# Altium schematic sheet MCU.SchDoc
size A; SheetNumber: 1; SheetTotal: 5
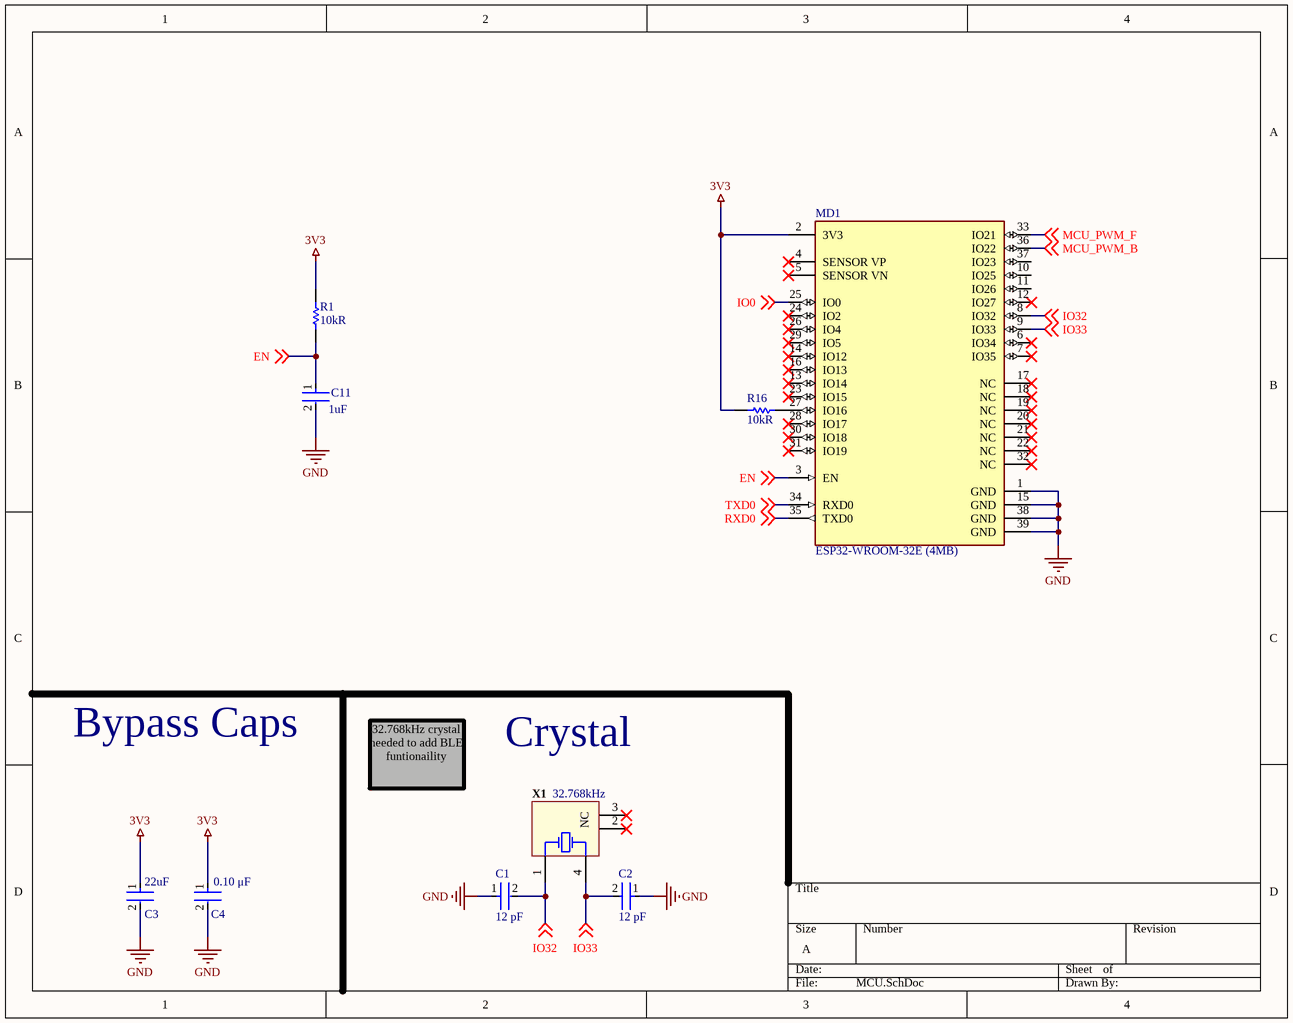
[diagram p0: MCU.SchDoc]

## Parts
C1  value 12 pF  [FP-C0805C-DN-MFG]  (hidden comment: C0805C120J5GACTU)
C2  value 12 pF  [FP-C0805C-DN-MFG]  (hidden comment: C0805C120J5GACTU)
C3  Capacitance: 22uF  [FP-GRM21B-0_15-MFG]  (hidden comment: GRM21BR60J226ME39L)
C4  value 0.10 μF  [FP-C1206C-EB-MFG]  (hidden comment: C1206C104K1RACTU)
C11  Capacitance: 1uF  [FP-CL21-IPC_A]  (hidden comment: CL21B105KOFNNNE)
MD1  ESP32-WROOM-32E (4MB)  [FP-ESP32-WROOM-32E_4MB-MFG]
R1  value 10kR  [RESC2013X60X35NL10T20]  (hidden comment: RC0805FR-0710KL)
R16  value 10kR  [RESC2013X60X35NL10T20]  (hidden comment: RC0805FR-0710KL)
X1  Frequency: 32.768kHz  [ABRA-ABS25-4_V]  (hidden comment: ABS25-32.768KHZ-6-T)

## Nets
3V3: C3.1 C4.1 MD1.2(3V3) R1.1 R16.2
GND: C1.1 C2.1 C3.2 C4.2 C11.2 MD1.1(GND) MD1.15(GND) MD1.38(GND) MD1.39(GND)
EN: C11.1 MD1.3(EN) R1.2 ; off-sheet EN
IO0: MD1.25(IO0) ; off-sheet IO0
IO32: C1.2 MD1.8(IO32) X1.1(X1) ; off-sheet IO32
IO33: C2.2 MD1.9(IO33) X1.4(X2) ; off-sheet IO33
MCU_PWM_B: MD1.36(IO22) ; off-sheet MCU_PWM_B
MCU_PWM_F: MD1.33(IO21) ; off-sheet MCU_PWM_F
RXD0: MD1.35(TXD0) ; off-sheet RXD0
TXD0: MD1.34(RXD0) ; off-sheet TXD0
NetMD1_27: MD1.27(IO16) R16.1

Not connected (* = marked no-connect by the designer): MD1 4(SENSOR_VP)* 5(SENSOR_VN)* 6(IO34)* 7(IO35)* 10(IO25) 11(IO26) 12(IO27)* 13(IO14)* 14(IO12)* 16(IO13)* 17(NC)* 18(NC)* 19(NC)* 20(NC)* 21(NC)* 22(NC)* 23(IO15)* 24(IO2)* 26(IO4)* 28(IO17)* 29(IO5)* 30(IO18)* 31(IO19)* 32(NC)* 37(IO23); X1 2(NC)* 3(NC)*

## Notes on the sheet
- Bypass Caps
- Crystal
- 32.768kHz crystal needed to add BLE funtionaility

## Library data of the parts
C1 C2 = CMP-2007-00441-2: CAP CER 12PF 50V C0G/NP0 0805; Manufacturer: KEMET; Temperature Characteristic: C0G; Temperature Coefficient: 30ppm/°C; Material: Ceramic; Tolerance: 0.05; Multilayer: Yes; Tolerance  (fill in as +-): 5%; Capacitance: 12 pF; Height: 0.88mm; ComponentLink2URL: https://content.kemet.com/datasheets/KEM_C1003_C0G_SMD.pdf; Automotive: No; Device Class L2: Capacitors; Digikey Description: CAP CER 12PF 50V C0G/NP0 0805; Device Class L3: Ceramic Capacitors; Voltage Rating: 50 V; Mouser Description: Multilayer Ceramic Capacitors MLCC - SMD/SMT 50volts 12pF C0G 5%; Device Class L1: Passive Components; ComponentLink2Description: Datasheet; RoHS: TRUE; Temperature Range High: +125°C; Lead Free: Yes; Category: Cap; Ipc Land Pattern Name: CAPC200125X78; Package: C0805C-DN; Manufacturer Part Number: C0805C120J5GACTU; Octopart: https://octopart.com/c0805c120j5gactu-kemet-126518; Temperature Range Low: -55°C; Temperature: -55°C to +125°C; Supplier: Digikey; Supplier Part Number: 399-C0805C120J5GAC7800CT-ND; Stock: 105044; Pricing: 1=0.12, 10=0.081, 50=0.0482, 100=0.038, 500=0.02804, 1000=0.02321 (USD); Mounting Technology: Surface Mount; Pins: 2; Dielectric Material: Ceramic; Case/Package: 0805; Terminal Finish: Nickel; Package Shape: Rectangular; Min Operating Temperature: -55°C; Max Operating Temperature: 125°C; JESD-609 Code: e3; Capacitor Type: Ceramic; Packaging: Tape and Reel; Tolerance (fill in as +-): 5%; Rated DC Voltage (URdc): 50V; Temperature Characteristics Code: C0G; Termination: Wraparound; Reach SVHC Compliant: Yes; RoHS Compliant: Yes; ComponentLink1URL: https://datasheet.ciiva.com:443/pdfs/VipMasterIC/IC/KEME/KEME-S-A0007600110/KEME-S-A0007597378-1.pdf?src-supplier=IHS+Markit; ComponentLink1Description: https://datasheet.ciiva.com:443/pdfs/VipMasterIC/IC/KEME/KEME-S-A0007600110/KEME-S-A0007597378-1.pdf?src-supplier=IHS+Markit
C3 = CMP-2007-03385-2: Chip Multilayer Ceramic Capacitors for General Purpose, 0805, 22uF, X5R, 15%, 20%, 6.3V; Manufacturer: Murata; Multilayer: Yes; Material: Ceramic; Max Operating Temperature: 85°C; Voltage: 6.3V; Min Operating Temperature: -55°C; Case/Package: 0805; Thickness: 0.053inch; Dielectric: X5R; Packaging: Tape and Reel; Depth: 1.25mm; Termination: SMD/SMT; Voltage Rating (DC): 6.3V; Radiation Hardening: No; Tolerance: 20%; Mount: Surface Mount; Lead Free: Lead Free; Package Quantity: 1; REACH SVHC: No SVHC; Voltage Rating: 6.3V; Length: 2mm; Case Code (Imperial): 0805; Case Code (Metric): 2012; Width: 0.049inch; Height: 1.25mm; Supplier: Digikey; Supplier Part Number: 490-1719-1-ND; Manufacturer Part Number: GRM21BR60J226ME39L; RoHS: Yes; Category: Ceramic Capacitors; Stock: 3670406; Pricing: 1=0.3, 10=0.196, 50=0.1444, 100=0.1177, 500=0.09288, 1000=0.07844 (USD); Mounting Technology: Surface Mount; Pins: 2; Dielectric Material: Ceramic; Package Shape: Rectangular; Terminal Finish: Nickel; JESD-609 Code: e3; Value: 22uF; Capacitor Type: Ceramic; Tolerance  (fill in as +-): 20%; Package Style: SMTMeter; Tolerance (fill in as +-): 20%; Rated DC Voltage (URdc): 6.3V; Temperature Characteristics Code: X5R; Reach SVHC Compliant: Yes; RoHS Compliant: Yes; ComponentLink1URL: https://psearch.en.murata.com:443/capacitor/product/GRM21BR60J226ME39%23.pdf?src-supplier=IHS+Markit; ComponentLink1Description: https://psearch.en.murata.com:443/capacitor/product/GRM21BR60J226ME39%23.pdf?src-supplier=IHS+Markit
C4 = CMP-03020-000153-1: CAP CER 0.1UF 100V X7R 1206; Manufacturer: KEMET; Tolerance: 0.1; Material: Ceramic; Temperature Coefficient: 15%; Automotive Grade: Grade 0; Multilayer: Yes; Tolerance  (fill in as +-): 10%; Voltage Rating: 100 V; Automotive: Yes; Ipc Land Pattern Name: CAPC320160X78; Device Class L1: Passive Components; ComponentLink2Description: Datasheet; Temperature Range Low: -55°C; Category: Cap; Octopart: https://octopart.com/c1206c104k1ractu-kemet-89521; Height: 0.88mm; Lead Free: Yes; Digikey Description: CAP CER 0.1UF 100V X7R 1206; Mouser Description: CAP CER 0.1UF 100V X7R 1206; Device Class L3: Ceramic Capacitors; Device Class L2: Capacitors; ComponentLink2URL: https://content.kemet.com/datasheets/KEM_C1007_X8R_ULTRA_150C_SMD.pdf; Temperature Range High: +150°C; Temperature Characteristic: X7R; Manufacturer Part Number: C1206C104K1RACTU; RoHS: TRUE; Capacitance: 0.10 μF; Package: C1206C-EB; Temperature: -55°C to +150°C; Supplier: Digikey; Supplier Part Number: 399-C1206C104K1RAC7800CT-ND; Stock: 96437; Pricing: 1=0.22, 10=0.144, 50=0.101, 100=0.0816, 500=0.0606, 1000=0.05302 (USD); Mounting Technology: Surface Mount; Pins: 2; Dielectric Material: Ceramic; Case/Package: 1206; Terminal Finish: Nickel; Package Shape: Rectangular; Min Operating Temperature: -55°C; Max Operating Temperature: 125°C; JESD-609 Code: e3; Capacitor Type: Ceramic; Packaging: Tape and Reel; Tolerance (fill in as +-): 10%; Rated DC Voltage (URdc): 100V; Temperature Characteristics Code: X7R; Package Style: SMTMeter; Termination: Wraparound; Length: 3.2mm; Width: 1.6mm; Reach SVHC Compliant: Yes; RoHS Compliant: Yes; ComponentLink1URL: https://datasheet.ciiva.com:443/pdfs/VipMasterIC/IC/KEME/KEME-S-A0008991654/KEME-S-A0008991654-1.pdf?src-supplier=IHS+Markit; ComponentLink1Description: https://datasheet.ciiva.com:443/pdfs/VipMasterIC/IC/KEME/KEME-S-A0008991654/KEME-S-A0008991654-1.pdf?src-supplier=IHS+Markit
C11 = CMP-13271-003098-1: CL21 Series 0805 1uF 16V ±10% Tolerance X7R Multilayer Ceramic Chip Capacitor; Manufacturer: Samsung; Description: Ceramic Capacitor, Multilayer, Ceramic, 16V, 10% +Tol, 10% -Tol, X7R, 15% TC, 1uF, Surface Mount, 0805; Multilayer: Yes; Case Code (Metric): 2012; Width: 0.049inch; Thickness: 0.053inch; Voltage Rating: 16V; Max Operating Temperature: 125°C; Case Code (Imperial): 0805; Height: 1.25mm; Length: 2mm; Case/Package: 0805; Lead Free: Lead Free; Mount: Surface Mount; Tolerance: 10%; Voltage Rating (DC): 16V; Min Operating Temperature: -55°C; Contact Plating: Tin; Depth: 1.25mm; Packaging: Tape and Reel; Package Quantity: 1; Voltage: 16V; Dielectric: X7R; Radiation Hardening: No; Supplier: Digikey; Supplier Part Number: 1276-1026-1-ND; Manufacturer Part Number: CL21B105KOFNNNE; RoHS: Yes; Category: Ceramic Capacitors; Stock: 390405; Pricing: 1=0.1, 10=0.049, 50=0.028, 100=0.0217, 500=0.01636, 1000=0.01286 (USD); Mounting Technology: Surface Mount; Pins: 2; Dielectric Material: Ceramic; Package Shape: Rectangular; Terminal Finish: Nickel; JESD-609 Code: e3; Value: 1uF; Capacitor Type: Ceramic; Tolerance  (fill in as +-): 10%; Package Style: SMTMeter; Tolerance (fill in as +-): 10%; Rated DC Voltage (URdc): 16V; Temperature Characteristics Code: X7R; Termination: Wraparound; Reach SVHC Compliant: Yes; RoHS Compliant: Yes; ComponentLink1URL: https://datasheet.ciiva.com:443/pdfs/VipMasterIC/IC/SEMS/SEMS-S-A0008523115/SEMS-S-A0008523189-1.pdf?src-supplier=IHS+Markit; ComponentLink1Description: https://datasheet.ciiva.com:443/pdfs/VipMasterIC/IC/SEMS/SEMS-S-A0008523115/SEMS-S-A0008523189-1.pdf?src-supplier=IHS+Markit; ComponentLink2URL: https://datasheet.ciiva.com/25800/cl21b105kofnnne-25800257.pdf?src-supplier=Digikey; ComponentLink2Description: https://datasheet.ciiva.com/25800/cl21b105kofnnne-25800257.pdf?src-supplier=Digikey; ComponentLink3URL: https://datasheet.ciiva.com/26838/getdatasheetpartid-358361-26838673.pdf?src-supplier=Verical; ComponentLink3Description: https://datasheet.ciiva.com/26838/getdatasheetpartid-358361-26838673.pdf?src-supplier=Verical; ComponentLink4URL: https://datasheet.ciiva.com/26310/mlcc-catalogdownload2013-eng-26310166.pdf?src-supplier=Distrelec; ComponentLink4Description: https://datasheet.ciiva.com/26310/mlcc-catalogdownload2013-eng-26310166.pdf?src-supplier=Distrelec
MD1 = CMP-194065-000026-1: RX TXRX MOD WIFI TRACE ANT SMD
R1 R16 = CMP-1659-00013-4: Chip Resistor, 10 KOhm, +/- 1%, 0.125 W, -55 to 155 degC, 0805 (2012 Metric), RoHS, Tape and Reel; Manufacturer: Yageo; Voltage Rating: 150 V; Power: 125mW; Rated Temperature: 70°C; Temperature Coefficient: 100ppm/°C; Additional Feature: LASER TRIMMABLE; Working Voltage: 150V; Package Length: 2mm; Package Height: 0.5mm; Package Width: 1.25mm; Mount: Surface Mount; ComponentLink1Description: Manufacturer URL; ComponentLink2URL: http://www.yageo.com/documents/recent/PYu-RC_Group_51_RoHS_L_04.pdf; Pins: 2; Length: 2 mm; Min Operating Temperature: -55 degC; Height: 0.5 mm; Mounting Technology: Surface Mount; RoHSCompliant: true; REACH SVHC: No SVHC; ComponentLink1URL: http://www.yageo.com/; Max Operating Temperature: 155 degC; PackageReference: 0805; DatasheetVersion: Rev. 4, 02/2016; Package Quantity: 5000; Packaging: Tape and Reel; ComponentLink2Description: Datasheet; PackageDescription: 2-Pin Surface Mounted Device, Body 2 x 1.25 mm; Supplier: Digikey; Supplier Part Number: 311-10.0KCRCT-ND; Manufacturer Part Number: RC0805FR-0710KL; RoHS: Yes; Category: Chip SMD Resistors; Stock: 4430741; Pricing: 1=0.1, 10=0.027, 50=0.017, 100=0.0142, 500=0.00976, 1000=0.00844 (USD); Package Shape: Rectangular; Terminal Finish: Nickel; Case/Package: 0805; Tolerance: 1%; JESD-609 Code: e3; Resistor Type: FIXED RESISTOR; Construction: Chip; Package Style: SMTMeter; Technology: METAL GLAZE/THICK FILM; Termination: Wraparound; Reach SVHC Compliant: Yes; RoHS Compliant: Yes; ComponentLink3URL: https://datasheet.ciiva.com:443/pdfs/VipMasterIC/IC/YAGO/YAGO-S-A0008145938/YAGO-S-A0008145938-1.pdf?src-supplier=IHS+Markit; ComponentLink3Description: https://datasheet.ciiva.com:443/pdfs/VipMasterIC/IC/YAGO/YAGO-S-A0008145938/YAGO-S-A0008145938-1.pdf?src-supplier=IHS+Markit; ComponentLink4URL: https://datasheet.ciiva.com/11808/0900766b8106beab-11808151.pdf?src-supplier=Rs; ComponentLink4Description: https://datasheet.ciiva.com/11808/0900766b8106beab-11808151.pdf?src-supplier=Rs; ComponentLink5URL: https://datasheet.ciiva.com/46447/444164-46447563.pdf?src-supplier=Element14; ComponentLink5Description: https://datasheet.ciiva.com/46447/444164-46447563.pdf?src-supplier=Element14; ComponentLink6URL: https://datasheet.ciiva.com/2456/pyu-r-int-thick-7-2456973.pdf?src-supplier=Digikey; ComponentLink6Description: https://datasheet.ciiva.com/2456/pyu-r-int-thick-7-2456973.pdf?src-supplier=Digikey; ComponentLink7URL: https://datasheet.ciiva.com/2456/pyu-r-int-thick-7-2456974.pdf?src-supplier=Digikey; ComponentLink7Description: https://datasheet.ciiva.com/2456/pyu-r-int-thick-7-2456974.pdf?src-supplier=Digikey; ComponentLink8URL: https://datasheet.ciiva.com/2456/pyu-r-int-thick-7-2456972.pdf?src-supplier=Digikey; ComponentLink8Description: https://datasheet.ciiva.com/2456/pyu-r-int-thick-7-2456972.pdf?src-supplier=Digikey; ComponentLink9URL: https://datasheet.ciiva.com/12669/rc0805-12669688.pdf?src-supplier=Mouser; ComponentLink9Description: https://datasheet.ciiva.com/12669/rc0805-12669688.pdf?src-supplier=Mouser; ComponentLink10URL: https://datasheet.ciiva.com/16747/rc0805-16747087.pdf?src-supplier=Future+Electronics; ComponentLink10Description: https://datasheet.ciiva.com/16747/rc0805-16747087.pdf?src-supplier=Future+Electronics
X1 = CMP-2000-05036-1: Low Frequency Crystal, 32.768 KHz, 6 pF, +/- 20 ppm, -40 to 85 degC, 4-Pin SMD, RoHS, Tape and Reel; Manufacturer: Abracon; Tolerance: 20PPM; ESR: 50kOhms; Case Width: 3.8mm; Case Height: 2.5mm; Case Length: 8mm; Load Capacitance: 6pF; Operating Temperature Range: -40Cto+85C; Package Reference: ABS25; Factory Pack Quantity: 3000; Package Description: 4-Pin Surface Mount Device, Body 8 x 3.8 mm, Pitch 5.5 mm; Termination Style: SMD/SMT; Manufacturer URL: http://www.abracon.com/; Type: LowFrequencyCrystal; Dimensions: 3.8mmWx8mmLx2.5mmH; Product Category: Crystals; Series: ABS25; RoHS: Details; Package / Case: 8mmx3.8mm; Datasheet Version: Jun-17; Brand: ABRACON; Datasheet URL: https://datasheet.ciiva.com/854/abs25-854528.pdf; Packaging: Reel; Mounting Style: SMD/SMT